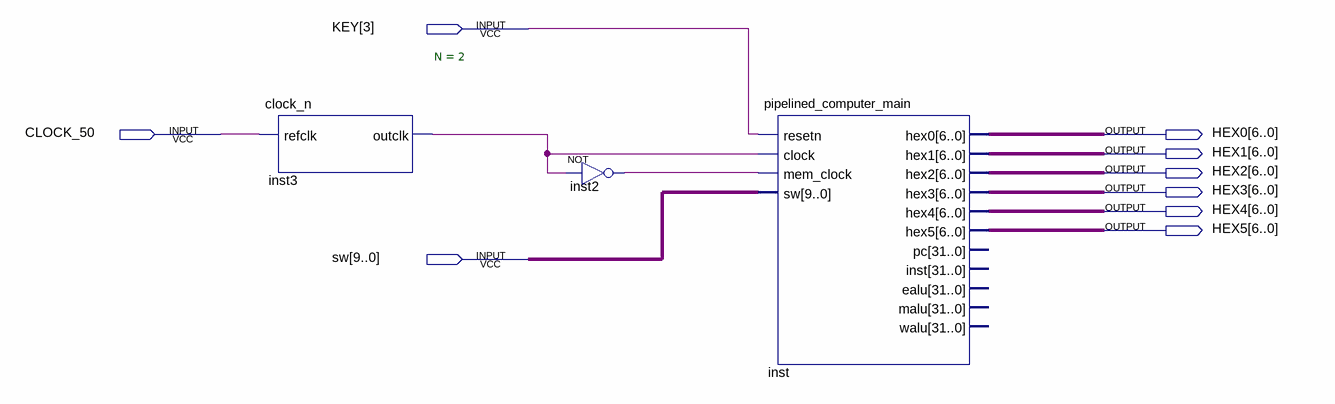
[diagram p0: schematic sheet]
// Quartus schematic pipelined_computer.bdf as structural Verilog: 3 symbols, 9 pins
module pipelined_computer (
  input  [3:3] KEY,
  input  CLOCK_50,
  input  [9:0] sw,
  output [6:0] HEX0,
  output [6:0] HEX1,
  output [6:0] HEX2,
  output [6:0] HEX3,
  output [6:0] HEX4,
  output [6:0] HEX5
);

  wire inst2_out, inst3_outclk;

  clock_n #(.N(2)) inst3 (.refclk(CLOCK_50), .outclk(inst3_outclk));
  not inst2 (inst2_out, inst3_outclk);
  pipelined_computer_main inst (
    .resetn(KEY[3]), .clock(inst3_outclk), .mem_clock(inst2_out), .sw(sw), .hex0(HEX0), .hex1(HEX1),
    .hex2(HEX2), .hex3(HEX3), .hex4(HEX4), .hex5(HEX5));  // open: pc, inst, ealu, malu, walu
endmodule
